# EasyEDA Pro project ProPrj_FOC_TEST_2025-02-24.epro, board PCB1_1
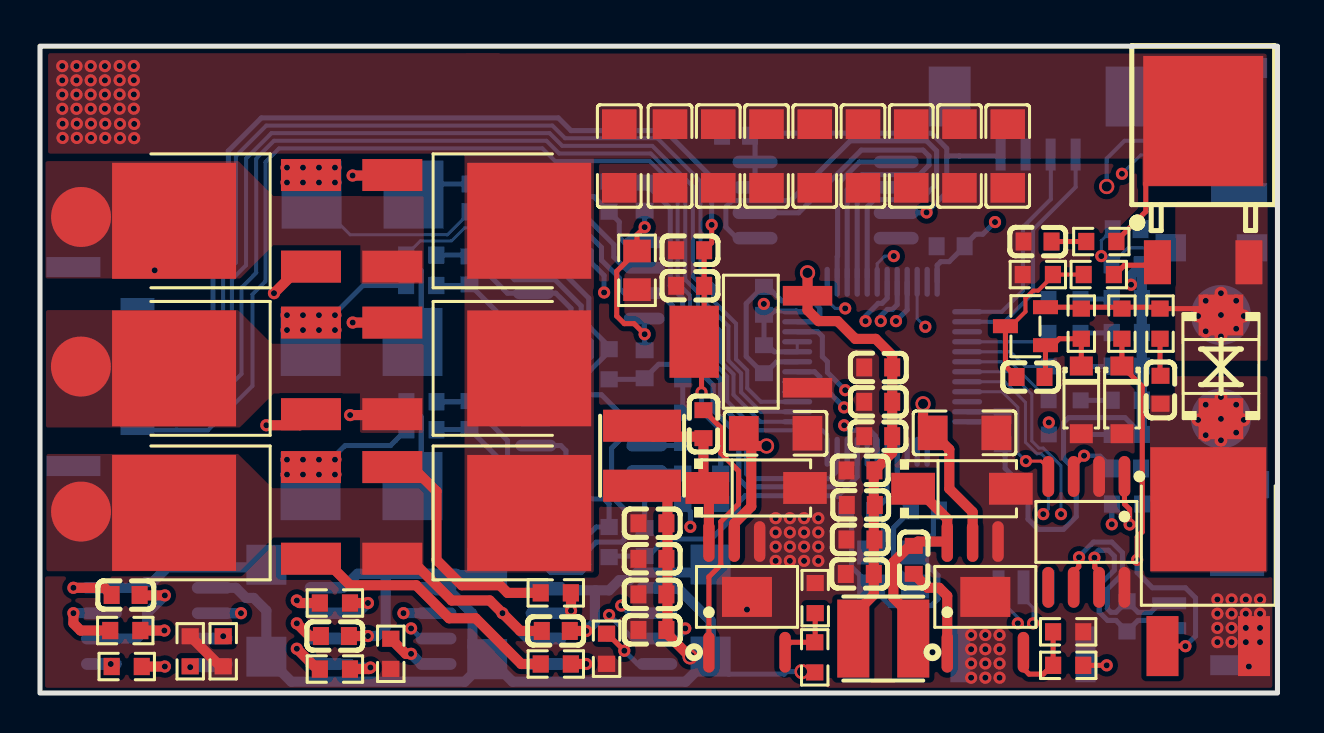
[diagram p8: board, top side]
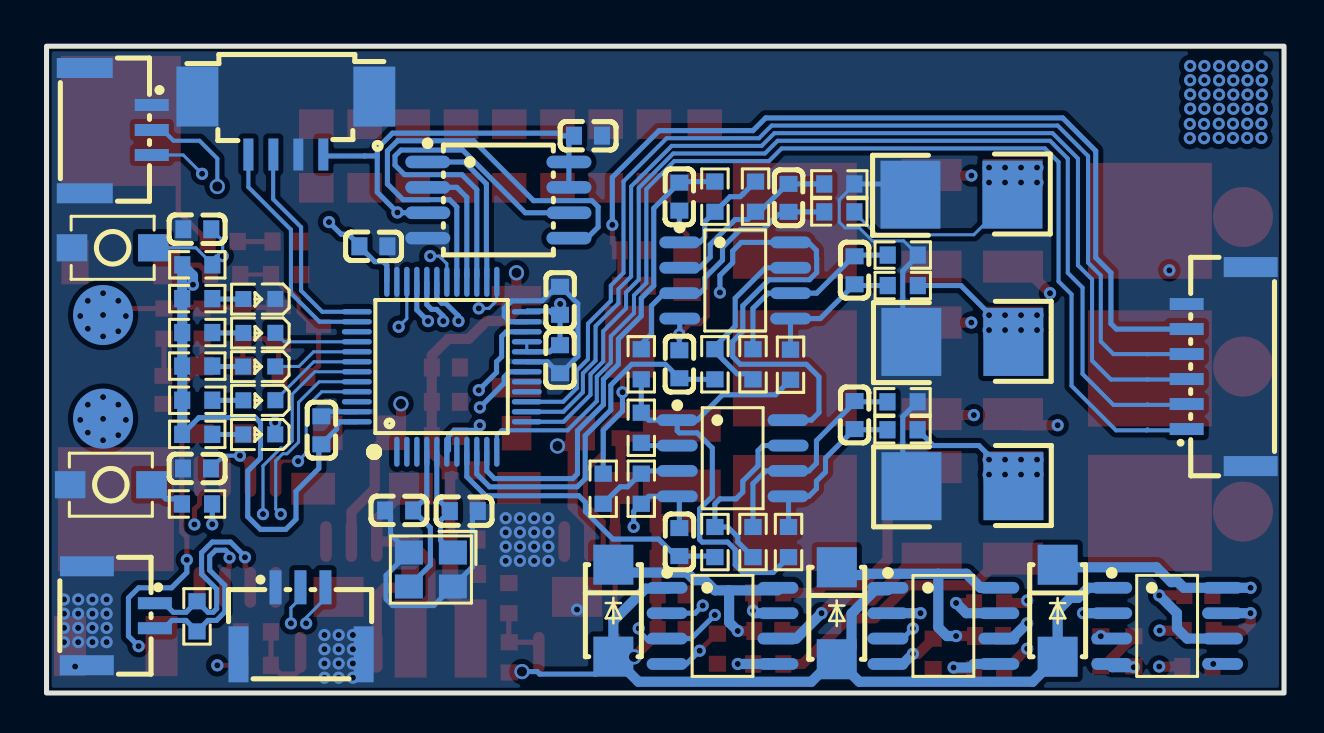
[diagram p9: board, bottom side, seen from below]

Outline 61.9 x 32.34 mm; copper layers: Top Layer, Inner1, Inner2, Bottom Layer. Coordinates in mm from the lower left corner of the outline.
Outline path: rectangle 0,32.34 61.9,0
Stack: Top Layer 0.035mm 外层铜厚1oz / Dielectric1 0.2104mm 7628 RC49% 8.6mil / Inner1 0.0152mm 内层铜厚 / Dielectric2 1.065mm 1.1mm H/HOZ 含铜 / Inner2 0.0152mm 内层铜厚 / Dielectric3 0.2104mm 7628 RC49% 8.6mil / Bottom Layer 0.035mm 外层铜厚1oz

## Design rules (mm)
net D-GND: DP1
net CAN-L: DP2
net CAN-H: DP2
net $3N2087: DP1
template: 自定义配置
spacing copperThickness1oz (default): track to track 0.102, other pairs 0.152 to 0.3
spacing copperThickness2oz: track to track 0.203, other pairs 0.152 to 0.3
track width copperThickness1oz (default): min 0.127, default 0.254, max 5.08
track width copperThickness2oz: min 0.203, default 0.254, max 2.54
differential pair differentialPair (default): width min 0.127, default 0.254, max 2.54; gap min 0.152, default 0.152
via viaSize (default): diameter min 0.5, default 0.61, max 10; hole min 0.3, default 0.305, max 6.299

## Placement (name value [footprint] x y rotation side)
C9  100nF  [C0603]  41.93 16.28 180 top
C10  100nF  [C0603]  32.52 22.14 0 top
C11  10uF  [C0603]  41.93 14.56 180 top
C12  10uF  [C0603]  32.52 20.36 0 top
C13  10uF  [C1206]  46.25 13.01 180 top
C14  10uF  [C1206]  36.8 12.99 180 top
C16  10uF  [C0603]  30.64 3.15 0 top
C17  10uF  [C0603]  30.64 4.93 0 top
C18  10uF  [C0603]  30.64 6.71 0 top
C19  22uF  [C0603]  30.64 8.49 0 top
C20  10uF  [C0603]  41.01 5.95 0 top
C21  10uF  [C0603]  41.04 7.67 0 top
C22  10uF  [C0603]  41.06 9.4 0 top
C23  10uF  [C0603]  41.04 11.13 0 top
C24  10uF  [C0603]  41.93 12.84 0 top
C28  100nF  [C0603]  54.36 23.19 180 bottom
C43  6pF  [C0603]  44.27 9.13 180 bottom
C44  100nF  [C0603]  45.55 22.34 0 bottom
C45  100nF  [C0603]  48.16 13.14 270 bottom
C48  6pF  [C0603]  41.03 9.1 0 bottom
C52  100nF  [C0603]  36.22 16.69 90 bottom
C54  100nF  [C0603]  54.38 11.23 0 bottom
C55  100nF  [C0603]  34.82 27.87 0 bottom
C56  4.7uF  [C0603]  25.8 3.1 0 top
C57  4.7uF  [C0603]  14.75 2.85 0 top
C58  4.7uF  [C0603]  4.28 4.9 180 top
C59  1uF  [C0603]  30.25 7.55 270 bottom
C60  1uF  [C0603]  30.25 16.44 270 bottom
C61  1uF  [C0603]  30.25 24.82 90 bottom
C62  47uF  [C1206]  48.41 26.85 90 top
C63  47uF  [C1206]  28.98 26.85 90 top
C64  47uF  [C1206]  31.52 26.85 90 top
C65  47uF  [C1206]  33.93 26.85 90 top
C66  47uF  [C1206]  36.34 26.85 90 top
C67  47uF  [C1206]  38.76 26.85 90 top
C68  47uF  [C1206]  41.17 26.85 90 top
C69  47uF  [C1206]  43.58 26.85 90 top
C70  47uF  [C1206]  46 26.85 90 top
C74  6pF  [C0603]  21.49 13.9 270 bottom
C75  6pF  [C0603]  21.49 21.14 270 bottom
C76  6pF  [C0603]  24.79 24.76 270 bottom
C78  1uF  [C0603]  49.9 22.58 180 top
C79  100nF  [C0603]  33.19 13.44 270 top
C80  100nF  [C0603]  43.71 6.66 90 top
C81  1uF  [C0603]  56.05 15.16 90 top
C82  100nF  [C0603]  49.55 15.8 180 top
C83  100nF  [C0603]  36.22 19.61 270 bottom
CN1  -  [CONN-SMD_1.25-4PWT]  49.93 28.38 180 bottom
D1  -  [SMB_L4.6-W3.6-LS5.3-BI]  59.08 16.31 90 top
D5  -  [SMA_L4.3-W2.5-LS5.0-FD]  46.12 10.21 180 top
D6  -  [DO-214AC_L4.3-W2.7-LS5.3-RD]  33.55 4.12 270 bottom
D7  -  [DO-214AC_L4.3-W2.7-LS5.3-RD]  22.37 3.99 270 bottom
D8  -  [DO-214AC_L4.3-W2.7-LS5.3-RD]  11.33 4.12 270 bottom
D9  -  [SMA_L4.3-W2.5-LS5.0-FD]  35.83 10.25 180 top
L4  15uH  [IND-SMD_L4.0-W4.0_FNR40XXS]  30.12 11.87 270 top
L5  15uH  [IND-SMD_L4.0-W4.0_FNR40XXS]  42.19 2.72 180 top
LED1  -  [LED_0603]  51.31 14.63 0 bottom
LED2  -  [LED_0603]  51.31 16.32 0 bottom
LED3  -  [LED_0603]  51.31 18 0 bottom
LED4  -  [LED_0603]  51.31 12.92 0 bottom
LED5  -  [LED_0603]  51.31 19.7 0 bottom
NOREF  -  [Pad_e794]  59.08 18.9 0 top
NOREF#2  -  [Pad_e793]  59.08 13.72 0 top
NOREF#3  -  [Pad_e4783]  2.05 23.8 0 top
NOREF#4  -  [Pad_e4786]  2.05 9.07 0 top
NOREF#5  -  [Pad_e4785]  2.05 16.32 0 top
Q3  -  [SOT-23-3_L2.9-W1.3-P1.90-LS2.4-BR]  49.3 18.34 0 top
Q5  -  [TO-252-2_L6.6-W6.1-P4.57-LS9.9-BR-CW]  58.44 5.77 270 top
Q6  -  [TO-252-2_L6.6-W6.1-P4.57-LS9.9-BR-CW]  21.05 9.01 180 top
Q7  -  [TO-252-2_L6.6-W6.1-P4.57-LS9.9-BR-CW]  21.05 16.23 180 top
Q8  -  [TO-252-2_L6.6-W6.1-P4.57-LS9.9-BR-CW]  21.05 23.61 180 top
Q9  -  [TO-252-2_L6.6-W6.1-P4.57-LS9.9-BR-CW]  10.13 9.01 0 top
Q10  -  [TO-252-2_L6.6-W6.1-P4.57-LS9.9-BR-CW]  10.13 16.23 0 top
Q11  -  [TO-252-2_L6.6-W6.1-P4.57-LS9.9-BR-CW]  10.13 23.61 0 top
Q13  IRFR5410TRPBF  [TO-252-2_L6.5-W6.1-P4.58-LS10.0-TR]  58.19 25.07 180 top
R1  22R  [R0603]  56.03 18.47 90 top
R4  22Ω  [R0603]  53.09 22.58 0 top
R13  10K  [R0603]  49.92 20.93 0 top
R15  0Ω  [R0805]  29.87 21.14 90 top
R19  12K  [R0603]  38.76 1.78 270 top
R20  5.1K  [R0603]  51.44 1.38 0 top
R21  1.5K  [R0603]  38.78 4.74 270 top
R22  1.5K  [R0603]  51.43 3.06 180 top
R30  120R  [R0603]  54.38 3.83 90 bottom
R31  10K  [R0603]  54.38 9.45 0 bottom
R32  10kΩ  [r0603]  54.36 21.41 0 bottom
R40  10K  [R0603]  34.06 10.21 90 bottom
R41  1K  [R0603]  19.08 14.56 180 bottom
R42  1K  [R0603]  19.08 13.16 180 bottom
R43  1K  [R0603]  19.07 21.9 180 bottom
R44  1K  [R0603]  19.07 20.37 180 bottom
R45  1K  [R0603]  22.25 25.45 180 bottom
R46  1K  [R0603]  22.25 24.06 180 bottom
R47  10R  [R0603]  14.75 4.5 180 top
R48  0R  [R0603]  17.55 1.96 90 top
R49  10R  [R0603]  14.75 1.2 180 top
R50  10K  [R0603]  32.15 10.21 90 bottom
R51  36.5K  [R0603]  26.57 7.55 90 bottom
R52  36.5K  [R0603]  24.79 7.55 90 bottom
R53  36.5K  [R0603]  26.57 16.44 90 bottom
R54  36.5K  [R0603]  24.69 16.42 90 bottom
R55  36.5K  [R0603]  26.44 24.82 270 bottom
R56  36.5K  [R0603]  32.15 16.44 90 bottom
R57  10K  [R0603]  32.15 13.26 90 bottom
R59  100R  [R0603]  28.47 7.55 90 bottom
R60  100R  [R0603]  28.47 16.44 90 bottom
R61  100R  [R0603]  28.47 24.82 270 bottom
R62  10R  [R0603]  4.27 3.12 0 top
R63  0R  [R0603]  7.52 2.09 270 top
R64  10R  [R0603]  4.34 1.32 0 top
R65  10K  [R0603]  9.17 2.09 90 top
R155  10K  [R0603]  54.37 14.64 180 bottom
R156  10K  [R0603]  54.37 16.35 180 bottom
R157  10K  [R0603]  54.37 18.02 180 bottom
R158  10K  [R0603]  54.37 12.93 180 bottom
R159  10K  [R0603]  54.37 19.72 180 bottom
R160  10R  [R0603]  25.8 5.01 180 top
R161  10R  [R0603]  25.8 1.45 180 top
R162  2mΩ  [RES-SMD_L6.4-W3.2-A]  16.09 10.34 180 bottom
R163  2mΩ  [RES-SMD_L6.4-W3.2-A]  16.09 17.55 180 bottom
R164  2mΩ  [RES-SMD_L6.4-W3.2-A]  16.14 24.92 180 bottom
R165  0R  [R0603]  28.34 2.21 90 top
R166  100K  [R0603]  54.12 18.47 90 top
R167  100K  [R0603]  52.09 18.47 90 top
R168  1K  [R0603]  52.97 20.93 0 top
SW3  轻触按键3*4*H  [SW-SMD_L4.0-W2.9-LS5.0]  58.6 22.26 0 bottom
SW4  轻触按键3*4*H  [SW-SMD_L4.0-W2.9-LS5.0]  58.69 10.42 180 bottom
U3  -  [SOIC-8_L5.0-W4.0-P1.27-LS6.0-BL-EP2.0]  35.37 4.81 0 top
U4  -  [SOIC-8_L5.0-W4.0-P1.27-LS6.0-BL-EP2.0]  47.29 4.81 0 top
U5  -  [SOT-223-4_L6.5-W3.5-P2.30-LS7.0-BR]  35.56 17.56 0 top
U12  -  [LQFP-48_L7.0-W7.0-P0.50-LS9.0-BL]  42.13 16.31 180 bottom
U13  -  [CONN-SMD_6P-P1.25_GH1.25-6PWBPZ]  3.27 16.32 90 bottom
U17  SN65HVD230DR  [SOIC-8_L4.9-W3.9-P1.27-LS6.0-BL]  52.35 8.06 180 top
U18  -  [SOIC-8_L5.2-W5.2-P1.27-LS7.9-BL]  39.3 24.65 270 bottom
U19  -  [SOIC-8_L4.9-W3.9-P1.27-LS6.0-BL]  27.45 20.63 270 bottom
U20  -  [SOIC-8_L4.9-W3.9-P1.27-LS6.0-BL]  28.09 3.36 270 bottom
U21  -  [SOIC-8_L4.9-W3.9-P1.27-LS6.0-BL]  17.04 3.36 270 bottom
U22  -  [SOIC-8_L4.9-W3.9-P1.27-LS6.0-BL]  5.85 3.36 270 bottom
U23  -  [SOIC-8_L4.9-W3.9-P1.27-LS6.0-BL]  27.58 11.74 270 bottom
U24  GH1.25-2P卧贴  [CONN-SMD_2P-P1.25_GH1.25-2PWBPZ]  58.19 3.86 270 bottom
U25  GH1.25-3P卧贴  [CONN-SMD_GH1.25-3P]  49.17 3.61 180 bottom
U26  GH1.25-3P卧贴  [CONN-SMD_GH1.25-3P]  58.32 28.12 270 bottom
X1  8MHz  [CRYSTAL-SMD_4P-L3.2-W2.5-BL]  42.68 6.17 0 bottom
ZD1  MMSZ5239B  [SOD-123_L2.8-W1.8-LS3.7-RD]  54.12 14.66 270 top
ZD2  MMSZ5239B  [SOD-123_L2.8-W1.8-LS3.7-RD]  52.09 14.66 270 top

## Footprints (pads in the part's own frame, mm; a bottom-side part is the same pattern mirrored in y, then rotated)
C0603
  rect 0.8x0.9 smd: 1(-0.7,0) 2(0.7,0)
C1206
  rect 1.485x1.728 smd: 1(-1.593,0) 2(1.593,0)
CONN-SMD_1.25-4PWT
  rect 0.5x1.6 smd: 1(1.875,-1.45) 2(0.625,-1.45) 3(-0.625,-1.45) 4(-1.875,-1.45)
  rect 2.1x2.999 smd: 5(4.425,1.45) 6(-4.425,1.45)
CONN-SMD_2P-P1.25_GH1.25-2PWBPZ
  rect 0.6x1.7 smd: 1(-0.625,1.702) 2(0.625,1.702)
  rect 1.001x2.7 smd: 3(-2.474,-1.696) 4(2.474,-1.702)
CONN-SMD_6P-P1.25_GH1.25-6PWBPZ
  rect 0.6x1.7 smd: 1(-3.125,1.6) 2(-1.875,1.6) 3(-0.625,1.6) 4(0.625,1.6) 5(1.875,1.6) 6(3.125,1.6)
  rect 1x2.7 smd: 7(-4.975,-1.6) 8(4.975,-1.6)
CONN-SMD_GH1.25-3P
  rect 0.6x1.7 smd: 1(-1.282,1.675) 2(-0.032,1.675) 3(1.218,1.675)
  rect 1x2.8 smd: 4(-3.132,-1.675) 5(3.132,-1.675)
CRYSTAL-SMD_4P-L3.2-W2.5-BL
  rect 1.4x1.2 smd: 1(-1.1,-0.85) 2(1.1,-0.85) 3(1.1,0.85) 4(-1.1,0.85)
DO-214AC_L4.3-W2.7-LS5.3-RD
  rect 1.999x1.999 smd: 1(-2.299,0) 2(2.301,0)
IND-SMD_L4.0-W4.0_FNR40XXS
  rect 1.6x3.9 smd: 1(-1.5,0) 2(1.5,0)
LED_0603
  rect 0.8x0.8 smd: 1(-0.851,-0.01) 2(0.75,-0.005)
LQFP-48_L7.0-W7.0-P0.50-LS9.0-BL
  oval 0.27x1.5 smd: 2(-2.25,-4.25) 3(-1.75,-4.25) 4(-1.25,-4.25) 5(-0.75,-4.25) 6(-0.25,-4.25) 7(0.25,-4.25) 8(0.75,-4.25) 9(1.25,-4.25) 10(1.75,-4.25) 11(2.25,-4.25) 12(2.75,-4.25) 25(2.75,4.25) 26(2.25,4.25) 27(1.75,4.25) 28(1.25,4.25) 29(0.75,4.25) 30(0.25,4.25) 31(-0.25,4.25) 32(-0.75,4.25) 33(-1.25,4.25) 34(-1.75,4.25) 35(-2.25,4.25) 36(-2.75,4.25)
  oval 1.5x0.27 smd: 13(4.25,-2.75) 14(4.25,-2.25) 15(4.25,-1.75) 16(4.25,-1.25) 17(4.25,-0.75) 18(4.25,-0.25) 19(4.25,0.25) 20(4.25,0.75) 21(4.25,1.25) 22(4.25,1.75) 23(4.25,2.25) 24(4.25,2.75) 37(-4.25,2.75) 38(-4.25,2.25) 39(-4.25,1.75) 40(-4.25,1.25) 41(-4.25,0.75) 42(-4.25,0.25) 43(-4.25,-0.25) 44(-4.25,-0.75) 45(-4.25,-1.25) 46(-4.25,-1.75) 47(-4.25,-2.25) 48(-4.25,-2.75)
Pad_e793
  round 3 smd far side: 1(0,0)
Pad_e794
  round 3 smd far side: 1(0,0)
Pad_e4783
  round 3 smd: 1(0,0)
Pad_e4785
  round 3 smd: 1(0,0)
Pad_e4786
  round 3 smd: 1(0,0)
R0603
  rect 0.806x0.864 smd: 1(-0.753,0) 2(0.753,0)
r0603
  rect 0.806x0.864 smd: 1(-0.753,0) 2(0.753,0)
R0805
  rect 1.133x1.377 smd: 1(-0.966,0) 2(0.966,0)
RES-SMD_L6.4-W3.2-A
  rect 2.999x3.401 smd: 1(-2.55,0) 2(2.55,0)
SMA_L4.3-W2.5-LS5.0-FD
  rect 2.184x1.593 smd: 1(-2.443,0) 2(2.443,0)
SMB_L4.6-W3.6-LS5.3-BI
  rect 2.047x2.24 smd: 1(-2.591,0) 2(2.591,0)
SOD-123_L2.8-W1.8-LS3.7-RD
  rect 0.95x1.15 smd: 1(-1.692,0) 2(1.692,0)
SOIC-8_L4.9-W3.9-P1.27-LS6.0-BL
  oval 0.588x2.045 smd: 1(-1.905,-2.772) 2(-0.635,-2.772) 3(0.635,-2.772) 4(1.905,-2.772) 5(1.905,2.772) 6(0.635,2.772) 7(-0.635,2.772) 8(-1.905,2.772)
SOIC-8_L5.0-W4.0-P1.27-LS6.0-BL-EP2.0
  oval 0.574x2.037 smd: 1(-1.905,-2.768) 4(1.905,-2.768) 6(0.635,2.768) 7(-0.635,2.768) 8(-1.905,2.768)
  rect 2.5x2 smd: 9(0,0)
SOIC-8_L5.2-W5.2-P1.27-LS7.9-BL
  oval 0.63x2.25 smd: 1(-1.905,-3.53) 2(-0.635,-3.53) 3(0.635,-3.53) 4(1.905,-3.53) 5(1.905,3.53) 6(0.635,3.53) 7(-0.635,3.53) 8(-1.905,3.53)
SOT-23-3_L2.9-W1.3-P1.90-LS2.4-BR
  rect 1.25x0.701 smd: 1(1.001,-0.95) 2(1.001,0.95) 3(-1.001,0)
SOT-223-4_L6.5-W3.5-P2.30-LS7.0-BR
  rect 2.47x0.98 smd: 1(2.835,-2.3) 3(2.835,2.3)
  rect 2.47x3.6 smd: 4(-2.835,0)
SW-SMD_L4.0-W2.9-LS5.0
  rect 1.53x1.36 smd: 1(-2.035,0) 2(2.035,0)
TO-252-2_L6.5-W6.1-P4.58-LS10.0-TR
  rect 1.35x2.2 smd: 1(2.29,3.533) 3(-2.29,3.533)
  rect 6x6.5 smd: 4(0,-3.533)
TO-252-2_L6.6-W6.1-P4.57-LS9.9-BR-CW
  rect 3x1.6 smd: 1(3.424,-2.29) 3(3.424,2.29)
  rect 6.2x5.8 smd: 2(-3.424,0)

## Nets
As in the schematic, except:
GROUND: C81.1 D1.1 NOREF#2.1 Q5.2
POWER: D1.2 NOREF.1 Q3.2 Q13.3 R1.2 R166.2 R167.2
U: C56.1 NOREF#4.1 Q6.3 Q9.2 U20.6
V: C57.1 NOREF#5.1 Q7.3 Q10.2 U21.6
W: C58.1 NOREF#3.1 Q8.3 Q11.2 U22.6

Pads without a net: U12 2 3 4 8 16 17 39 46; U17 5

## Via types
v1: diameter 0.61, hole 0.305, Top Layer to Bottom Layer, 149 vias
v2: diameter 0.762, hole 0.508, Top Layer to Bottom Layer, 6 vias
v3: diameter 0.65, hole 0.3, Top Layer to Bottom Layer, 42 vias

## Routing (per net, layer and track width the routed paths; a pad name or vN(x,y) marks a point on that pad's centre or on a via; arc(x,y) is an arc through that point)
3.3V: length 138.8
  Top Layer w0.254: v1(33.09,15.04) 33.09,17.2 U5.4 33.22,18.06 C12.2 C10.2 33.6,22.52 v1(33.6,23.41)
  Bottom Layer w0.152: 37.22,17.56 U12.21 U12.20
  Bottom Layer w0.254: C83.2 C52.2 36.41,17.39 36.73,17.06 U12.20 ; C83.2 36.53,18.91 36.73,19.1 37.84,19.1 U12.24 ; C83.2 36.22,19.45 v1(36.21,19.46) ; 55.12,12.94 54.28,13.77 51.46,13.77 51.2,13.52 51.2,11.74 51.84,11.1 51.84,8.82 51.2,8.18 49.93,8.18 49.43,8.69 49.43,10.09 48.28,11.23 48.28,12.31 C45.2 47.39,13.2 47.39,13.39 47.22,13.56 U12.48 ; v1(47.77,23.55) 47.17,22.94 46.81,22.94 46.25,22.39 C44.2 45.49,21.57 45.06,21.57 44.88,21.39 U12.36 ; U23.8 23.64,13.64 23.26,14.02 23.26,15.8 23.9,16.44 27.2,16.44 27.58,16.82 27.58,17.58 27.1,18.06 27.1,18.19 27.07,18.22 27.07,19.36 25.77,20.67 23.74,20.67 23.38,21.03 23.38,21.76 23.39,21.77 23.39,22.13 23.79,22.53 U19.8 27.15,22.53 27.58,22.1 27.58,21.52 28.22,20.88 v1(28.22,20.03) ; U18.7 U18.8 35.77,27.62 C55.2 36.17,27.87 36.3,27.99 44.6,27.99 45.36,27.23 45.36,26.85 ; 45.36,26.85 45.36,25.04 v1(44.35,24.03) 44.33,24.01 U18.3 ; 45.36,26.85 45.99,26.85 46,26.85 48.01,26.85 48.06,26.8 ; R40.2 34.06,13.14 33.09,14.1 v1(33.09,15.04) ; v1(33.6,23.41) 33.6,25.78 31.26,28.12 26.57,28.12 25.93,28.76 11.07,28.76 9.42,27.11 9.42,21.77 8.66,21.01 8.66,18.47 8.39,18.2 U13.5
  Bottom Layer w0.508: v1(54.58,20.42) 54.58,20.88 R32.2 55.12,19.72 R159.1 55.12,19.72 55.12,12.94 R158.1
5V: length 79.7
  Top Layer w0.254: U17.3 51.71,11.36 52.22,11.87 v1(52.23,11.87) ; 52.19,1.38 v1(53.36,1.38)
  Top Layer w0.508: v2(38.4,21.01) U5.3 38.4,19.15 38.95,18.6 39.9,18.6 40.79,17.71 41.81,17.71 42.63,16.88 C9.1 C11.1 C24.2 42.63,12.02 41.71,11.1 C20.2 41.71,4.91 40.58,3.79 40.58,2.84
  Inner1 w0.508: v2(38.4,21.01) 43.33,21.01 47.65,25.33 v2(53.36,25.33) 55.52,23.17 55.52,8.31 54.63,7.42 53.99,7.42 ; 53.99,7.42 53.99,2.01 v1(53.36,1.38) ; 53.99,7.42 53.36,7.42 52.74,8.04 52.74,11.36 v1(52.23,11.87)
  Bottom Layer w0.203: v2(53.36,25.33) 53.36,26.72 54.25,27.61 55.55,27.61 56.06,28.12 56.61,28.12 ; v1(52.23,11.87) 53.04,11.87 C54.1
5V-FD: length 4.3
  Top Layer w0.254: U4.4 49.3,1.93 49.3,1.12 49.48,0.94 50.19,0.94 50.63,1.38 R20.1 50.68,1.39 50.68,3.06
11V: length 56.7
  Top Layer w0.254: R19.2 38.72,1.07 v2(38.12,1.07)
  Top Layer w0.508: v2(32.52,1.81) 31.39,2.94 31.39,10.25 30.06,10.25
  Bottom Layer w0.254: v2(38.12,1.07) 37.36,1.07 37.23,0.94 34.44,0.94 33.57,1.82 D6.2
  Bottom Layer w0.508: D6.2 33.55,3.61 31.94,5.22 30.84,5.22 ; D6.2 32.3,0.56 23.64,0.56 22.52,1.69 22.37,1.69 22.31,1.62 ; D6.2 32.53,1.82 v2(32.52,1.81) ; 22.31,1.62 21.63,2.3 21.63,3.97 20.47,5.13 19.81,5.13 ; 22.31,1.62 21.25,0.56 12.58,0.56 D8.2 11.33,4.12 10.69,4.75 10.31,4.75 9.8,5.26 U22.1
12V-FD: length 3.9
  Top Layer w0.254: R21.2 38.78,2.56 R19.1 37.56,2.54 37.27,2.25 37.27,1.4
24V-CALC-OUT: length 22.5
  Top Layer w0.254: Q13.4 58.19,28.36 55.32,25.48 55.32,24.08 53.85,22.6 R4.2
  Top Layer w0.508: U3.7 34.73,8.48 35.58,9.33 35.58,12.61 ; v2(36.34,12.35) 35.84,12.35 35.58,12.61 ; v2(44.18,14.46) 44.18,13.49 C13.2 45.49,12.18 45.49,10.21 46.66,9.05 U4.7 ; 35.58,12.61 C14.2
  vias: v1(1.11,31.35) v1(1.11,30.64) v1(1.11,29.93) v1(1.11,29.21) v1(1.13,28.47) v1(1.13,27.76) v1(1.83,31.35) v1(1.83,30.64) v1(1.83,29.93) v1(1.83,29.21) v1(1.84,28.47) v1(1.84,27.76) v1(2.54,31.35) v1(2.54,30.64) v1(2.54,29.93) v1(2.54,29.21) v1(2.55,28.47) v1(2.55,27.76) v1(3.25,31.35) v1(3.25,30.64) v1(3.25,29.93) v1(3.25,29.21) v1(3.27,28.47) v1(3.27,27.76) v1(3.98,31.35) v1(3.98,30.64) v1(3.98,29.93) v1(3.98,29.22) v1(4,28.46) v1(4,27.75) v1(4.7,31.35) v1(4.7,30.64) v1(4.7,29.93) v1(4.7,29.22) v1(4.71,28.46) v1(4.71,27.75)
AGND: length 14.3
  Top Layer w0.254: v1(30.25,23.3) 29.87,22.91 R15.2 28.85,21.09 28.85,18.85 29.23,18.47 29.72,18.47 v1(30.25,17.94) ; 29.82,21.72 29.99,21.72
  Bottom Layer w0.254: C59.1 30.25,9.73 U23.4 31.78,9.83 R50.1 32.53,9.08 v1(32.53,8.31) ; C60.1 v1(30.25,17.94) 30.23,17.96 U19.4 ; v1(30.25,23.3) C61.1
V1: length 19.7
  Top Layer w0.508: v1(15.64,18.52) 17.62,18.52 ; R47.2 12.98,4.5 v1(12.85,4.63)
  Inner1 w0.508: v1(15.64,18.52) 15.64,17.51 14.37,16.24 14.37,13.16 15.64,11.89 15.64,6.66 13.61,4.63 v1(12.85,4.63)
V2: length 15.8
  Top Layer w0.508: R49.2 13.87,1.2 v1(12.85,2.21) ; v1(11.33,13.39) 13,13.39 Q10.1
  Inner1 w0.508: v1(12.85,2.21) 11.33,3.74 v1(11.33,13.39)
ADC-U: length 15.6
  Bottom Layer w0.254: R59.1 28.52,6.85 C59.2 30.44,6.85 31.29,7.7 33.57,7.7 34.95,9.07 34.95,9.53 35.28,9.87 39.85,9.87 39.89,9.82 40.88,10.81 U12.9
ADC-V: length 18.1
  Bottom Layer w0.254: U12.10 40.38,10.95 39.74,10.31 35.36,10.31 34.96,10.71 34.96,12.87 33.68,14.15 33.68,15.39 32.63,16.44 30.95,16.44 30.2,15.68 R60.1
ADC-W: length 24.2
  Bottom Layer w0.254: R61.1 30.2,25.57 C61.2 31.53,24.24 31.53,20.36 32.15,19.74 32.15,18.85 33.3,17.71 33.3,16.44 34.05,15.69 34.05,14.42 35.35,13.12 35.35,10.96 35.58,10.72 39.5,10.72 39.88,11.1 U12.11
CAN-H: length 10.3
  Top Layer w0.254: U17.7 52.98,6.06 52.77,6.28 52.77,6.75 v1(52.75,6.77)
  Bottom Layer w0.254: v1(52.75,6.77) 52.75,6.94 52.96,7.14 53.45,7.14 53.74,6.85 53.74,6.14 52.99,5.39 52.99,4.05 53.41,3.63 53.83,3.63 R30.1 54.93,3.63 55.63,3.63 56.02,3.24 U24.2
CAN-L: length 11.3
  Top Layer w0.254: U17.6 51.71,6.06 51.97,6.31 51.97,6.77 v1(51.98,6.79)
  Bottom Layer w0.254: v1(51.98,6.79) 51.98,6.83 52.7,7.55 53.62,7.55 54.15,7.01 54.15,5.95 53.39,5.19 53.39,4.22 53.57,4.04 53.83,4.04 R30.2 54.93,4.04 55.56,4.04 56.02,4.49 U24.1
D-GND: length 49.1
  Top Layer w0.508: R63.1 9.02,1.33 R65.1
  Bottom Layer w0.152: R43.2 19.03,22.61 20.59,22.61 21.24,23.26 21.96,23.26 22.25,23.55 22.25,24.67 21.49,25.43 R45.2
  Bottom Layer w0.254: 36.22,20.29 36.43,20.29 37.11,19.61 38.63,19.61 39.01,19.23 39.01,18.85 38.72,18.56 U12.23 ; 36.28,15.99 36.85,16.56 U12.19 ; R41.2 19.07,13.82 19.07,10.84 18.57,10.34 ; C48.1 40.6,8.82 40.6,6.3 X1.4 42.53,4.37 44.6,4.37 44.92,4.7 44.92,5.88 X1.2 44.7,7.94 44.7,8.86 C43.1 ; R164.1 19.55,24.92 20.09,25.45 R45.2 ; R163.1 18.64,17.76 19.07,18.19 19.07,21.12 18.32,21.87 R43.2 ; U12.47 47.93,14.06 C45.1 ; C83.1 36.17,20.31 35.33,19.47 35.33,16.83 36.17,15.99 C52.1 ; 18.5,17.46 18.62,17.58
  vias: v1(35.37,4.17) v1(36.8,8.74) v1(36.8,8.03) v1(36.8,7.32) v1(36.8,6.61) v1(37.51,8.74) v1(37.51,8.03) v1(37.51,7.32) v1(37.51,6.61) v1(38.22,8.74) v1(38.22,8.03) v1(38.22,7.32) v1(38.22,6.61) v1(38.94,8.74) v1(38.94,8.03) v1(38.94,7.32) v1(38.94,6.61) v1(46.58,2.9) v1(46.58,2.19) v1(46.58,1.48) v1(46.58,0.77) v1(47.29,2.9) v1(47.29,2.19) v1(47.29,1.48) v1(47.29,0.77) v1(48,2.9) v1(48,2.19) v1(48,1.48) v1(48,0.77) v1(58.9,4.68) v1(58.9,3.97) v1(58.9,3.26) v1(58.9,2.54) v1(59.61,4.68) v1(59.61,3.97) v1(59.61,3.26) v1(59.61,2.54) v1(60.32,4.68) v1(60.32,3.97) v1(60.32,3.26) v1(60.32,2.54) v1(60.47,1.32) v1(61.03,4.68) v1(61.03,3.97) v1(61.03,3.26) v1(61.03,2.54)
FDCAN-RX: length 7.4
  Top Layer w0.152: U17.4 50.44,11.23 50.08,11.59 v1(49.32,11.59)
  Bottom Layer w0.152: v1(49.32,11.59) 48.92,12 48.92,14.28 48.14,15.06 U12.45
FDCAN-TX: length 21.9
  Top Layer w0.254: U17.1 54.25,9.45 54.51,9.2 v1(54.51,8.43)
  Inner1 w0.254: v1(44.29,18.31) 44.29,16.49 44.85,15.93 49.68,15.93 54.25,11.36 54.25,9.45 54.51,9.2 v1(54.51,8.43)
  Bottom Layer w0.152: v1(44.29,18.31) 43.88,18.72 U12.34
GROUND:
  vias: v3(57.93,13.66) v3(58.32,14.42) v3(58.32,12.89) v3(59.08,14.8) v3(59.08,13.71) v3(59.08,12.64) v3(59.84,14.42) v3(59.84,13.02) v3(60.22,13.66)
I-VREF: length 23.5
  Bottom Layer w0.254: U23.1 31.78,13.64 R57.2 R56.1 ; U23.1 30.35,13.11 30.25,13.01 29.36,13.01 28.6,12.25 28.6,9.83 29.23,9.2 29.23,7.67 29.11,7.55 27.84,7.55 27.45,7.17 27.45,6.4 27.07,6.02 25.56,6.02 R52.1 ; U23.1 29.36,13.64 28.09,14.91 25.44,14.91 R54.1
ID_BUTTON: length 23.5
  Inner1 w0.254: v1(40.28,15.14) 40.89,15.14 41.25,15.5 49.48,15.5 53.62,11.36 53.62,8.56
  Bottom Layer w0.254: R31.1 53.62,9.44 v1(53.62,8.44) ; U12.22 38.91,18.06 39.14,17.83 39.14,16.82 39.39,16.56 39.39,16.03 v1(40.28,15.14)
LED0: length 4.9
  Bottom Layer w0.152: LED1.1 48.54,16.56 U12.42
LED1: length 4.4
  Bottom Layer w0.152: U12.41 48.55,17.06 49.28,16.33 50.46,16.33
LED2: length 4.3
  Bottom Layer w0.152: LED3.1 50.01,17.56 U12.40
LED-WARNING: length 15.3
  Inner1 w0.254: v1(50.47,13.53) 50.47,13.87 49.2,15.14 41.53,15.14 40.66,14.28 v1(40.23,14.28)
  Bottom Layer w0.254: v1(40.23,14.28) 39.01,15.49 39.01,15.8 38.75,16.06 U12.18 ; LED4.1 50.47,12.94 v1(50.47,13.53)
MOTOR_CSN: length 66.6
  Inner1 w0.254: v1(9.17,2.84) 11.32,0.69 13.61,0.69 15.01,2.09 17.42,2.09 v1(18.56,3.23) 18.95,3.61 18.95,4.25 22.25,7.55 27.84,7.55 28.34,7.04 28.34,4.03 v1(28.47,3.9) ; v1(40.28,19.23) 43.15,19.23 43.41,18.98 43.41,17.53 42.06,16.18 33.3,16.18 29.74,12.63 29.74,3.99 30.5,3.23 v1(32.28,3.23)
  Bottom Layer w0.152: U12.25 39.39,20.55 39.39,19.61 39.77,19.23 v1(40.28,19.23)
  Bottom Layer w0.254: v1(28.47,3.9) 29.65,2.72 U20.3 ; v1(18.56,3.23) 19.07,2.72 U21.3 ; 30.86,2.59 31.77,2.59 32.28,3.1 v1(32.28,3.23)
NRST: length 32.3
  Inner1 w0.152: v1(53.09,21.85) 53.09,24.45 52.98,24.57 47.77,24.57 43.71,20.5 43.71,17.2 42.31,15.8 40.15,15.8 39.65,15.29 39.65,13.97 v1(40.23,13.39)
  Bottom Layer w0.152: 53.72,21.55 53.61,21.44 R32.1 ; 53.72,21.55 53.42,21.85 v1(53.09,21.85) 53.09,22.62 C28.2 ; 53.72,21.55 54.43,22.26 SW3.1
  Bottom Layer w0.254: v1(40.23,13.39) 40.48,13.14 41.51,13.14 41.8,12.85 41.8,12.15 U12.7
OSC+: length 7.8
  Bottom Layer w0.254: X1.3 42.7,6.4 42.7,8.27 C43.2 42.88,9.82 U12.5
OSC-: length 5.8
  Bottom Layer w0.254: X1.1 42.2,7.64 42.2,8.63 41.73,9.1 42.38,9.75 U12.6
POWER: length 8.8
  Top Layer w0.254: v3(59.08,18.9) 58.76,19.22 R1.2 55.96,19.29 50.43,19.29
  vias: v3(57.93,18.85) v3(58.32,19.61) v3(58.32,18.09) v3(59.08,19.99) v3(59.08,17.83) v3(59.84,19.61) v3(59.84,18.22) v3(60.22,18.85)
PWM-U: length 29.3
  Inner1 w0.508: v1(42.82,18.6) 42.82,17.71 41.81,16.69 32.92,16.69 29.08,12.86 v1(29.08,4.37)
  Bottom Layer w0.254: U12.33 43.38,19.16 v1(42.82,18.6) ; 30.86,3.99 29.46,3.99 v1(29.08,4.37)
PWM-V: length 36.7
  Inner1 w0.508: v1(42.06,18.6) 42.06,18.04 41.35,17.33 32.28,17.33 28.25,13.29 28.25,10.12 26.44,8.31 21.61,8.31 18.18,4.88 v1(18.18,3.99)
  Bottom Layer w0.254: v1(42.06,18.6) 42.06,18.85 42.39,19.18 42.64,19.18 42.88,19.42 U12.32
  Bottom Layer w0.508: v1(18.18,3.99) 19.81,3.99
PWM-W: length 46.5
  Inner1 w0.508: v1(41.3,18.6) 40.79,18.09 31.52,18.09 27.2,13.77 27.2,10.6 25.84,9.23 21.01,9.23 17.39,5.61 17.39,4.21 16.79,3.61 15.39,3.61 13.1,1.32 12.09,1.32 10.06,3.36 v1(10.06,3.99)
  Bottom Layer w0.254: U12.31 42.38,19.74 42.13,19.49 41.93,19.49 41.3,18.85 v1(41.3,18.6)
  Bottom Layer w0.508: 8.62,3.99 10.06,3.99
SPI1-CLK: length 54.9
  Bottom Layer w0.203: 6.86,14.41 8.53,14.41 10.08,15.95 10.08,20.27 10.82,21.01 10.82,26.72 11.71,27.61 25.33,27.61 25.97,26.98 30.55,26.98 32.28,25.25 32.28,20.67 32.92,20.03 32.92,19.23 34.06,18.09 34.06,16.57 34.69,15.94 34.69,14.91 36.04,13.56 U12.13 ; 6.86,14.41 4.91,14.41 U13.2 ; 6.86,14.41 6.83,14.44
SPI1-CSN: length 58.2
  Bottom Layer w0.203: 6.88,13.14 4.93,13.14 U13.1 ; 6.88,13.14 6.83,13.19 ; 6.88,13.14 8.4,13.14 10.63,15.36 10.63,19.93 11.28,20.58 11.28,26.55 11.96,27.23 25.13,27.23 25.77,26.6 30.5,26.6 31.9,25.2 31.9,20.5 32.52,19.88 32.52,18.99 33.68,17.83 33.68,16.52 34.38,15.82 34.38,14.59 35.84,13.14 39.14,13.14 39.38,12.89 U12.12
SPI1-MISO: length 54
  Bottom Layer w0.203: U13.3 4.89,15.68 6.84,15.68 ; 6.84,15.68 8.66,15.68 9.6,16.62 9.6,20.69 10.31,21.39 10.31,26.72 11.58,27.99 25.49,27.99 26.13,27.36 30.63,27.36 32.66,25.33 32.66,20.83 33.3,20.19 33.3,19.49 34.44,18.34 34.44,16.62 35.07,15.99 35.07,15.04 36.05,14.06 U12.14 ; 6.84,15.68 6.83,15.69
SPI1-MOSI: length 53.2
  Bottom Layer w0.203: 6.84,16.95 8.53,16.95 9.17,17.58 9.17,20.88 9.8,21.52 9.8,26.85 11.33,28.38 25.63,28.38 26.27,27.74 30.88,27.74 33.04,25.58 33.04,21.01 33.68,20.37 33.68,19.61 34.82,18.47 34.82,16.69 35.38,16.13 35.38,15.24 36.06,14.56 U12.15 ; 6.84,16.95 4.87,16.95 U13.4 ; 6.84,16.95 6.83,16.94
SPI2-CLK: length 19.5
  Bottom Layer w0.254: 40.38,20.82 40.38,25.17 41.13,25.92 44,25.92 44.47,26.39 44.47,26.85 44.18,27.15 41.09,27.15 37.95,24.01 U18.6
SPI2-CSN: length 8
  Bottom Layer w0.254: 39.88,20.82 39.88,21.82 39.9,21.84 39.9,25.45 41,26.55 U18.1
SPI2-MISO: length 6.1
  Bottom Layer w0.254: 40.88,20.82 40.88,24.78 41.38,25.28 U18.2
SPI2-MOSI: length 23.9
  Bottom Layer w0.254: U18.5 34.86,22.74 34.31,23.3 34.31,24.31 34.62,24.62 37.54,24.62 40.54,27.61 44.35,27.61 44.85,27.11 44.85,25.45 44.07,24.67 41.74,24.67 41.38,24.31 41.38,20.82
SWCLK: length 11.7
  Bottom Layer w0.203: U12.38 48.25,18.56 49.68,19.99 49.68,23.17 51.81,25.3 CN1.4
SWDIO: length 10.6
  Bottom Layer w0.203: CN1.3 50.57,26.92 50.57,24.69 49.17,23.3 49.17,20.12 48.11,19.06 U12.37
TIM1-CH1: length 17.9
  Inner1 w0.152: v1(54.12,25.96) 47.39,25.96 43.28,21.85 v1(42.71,21.85)
  Bottom Layer w0.152: 56.59,26.85 56.59,26.9 55.06,26.9 v1(54.12,25.96) ; v1(42.71,21.85) 42.26,21.85 41.88,21.47 U12.30
U: length 11.7
  Top Layer w0.508: C56.1 24.03,3.1 v1(23.14,3.99) 22.5,4.63 20.6,4.63 18.25,6.97 17.63,6.97
  Bottom Layer w0.508: 25.19,2.72 24.41,2.72 v1(23.14,3.99)
U1: length 12.1
  Top Layer w0.508: R160.2 23.39,5.01 23.01,5.39 21.1,5.39 19.83,6.66 19.83,10.09 18.37,11.55 17.63,11.55
U2: length 13.7
  Top Layer w0.508: R161.2 24.08,1.45 21.79,3.74 20.47,3.74 18.82,5.39 15.52,5.39 14.19,6.72 Q9.1
USART1-RX: length 17.8
  Inner1 w0.152: v1(50.19,8.94) 48.92,7.67 v1(48.92,3.48)
  Bottom Layer w0.152: v1(48.92,3.48) 48.92,3.77 47.95,4.74 U25.3 ; U12.44 48.27,15.56 49.3,14.53 49.3,12.54 49.87,11.96 50.09,11.96 50.44,11.61 50.44,9.2 v1(50.19,8.94)
USART1-TX: length 18.5
  Inner1 w0.152: v1(49.68,3.48) 49.68,7.55 v1(51.08,8.94)
  Bottom Layer w0.152: v1(51.08,8.94) 51.08,11.36 50.19,12.25 49.97,12.25 49.62,12.6 49.62,14.94 48.49,16.06 U12.43 ; U25.2 49.2,4.74 49.68,4.26 v1(49.68,3.48)
V: length 18.4
  Top Layer w0.508: Q7.3 17.58,13.9 v1(15.52,13.9) ; v1(12.85,3.48) 13.48,2.85 C57.1
  Inner1 w0.508: v1(15.52,13.9) 15.52,13.15 16.66,12.01 16.66,6 14.15,3.48 v1(12.85,3.48)
  Bottom Layer w0.508: 14.14,2.72 13.61,2.72 v1(12.85,3.48)
W: length 24.2
  Top Layer w0.508: C58.1 5.01,4.88 v1(6.25,4.88)
  Inner1 w0.508: v1(6.25,4.88) 8.28,6.91 8.28,19.1 6.25,21.14 v1(5.74,21.14)
  Bottom Layer w0.508: v1(6.25,4.88) 5.36,3.99 5.36,3.23 4.85,2.72 U22.6
W1: length 31.7
  Top Layer w0.508: Q8.1 17.6,25.88 v1(15.64,25.88) ; R62.2 v1(6.22,3.12)
  Inner1 w0.508: v1(6.22,3.12) 9.17,6.07 9.17,19.36 11.58,21.77 14.75,21.77 15.64,22.66 v1(15.64,25.88)
W2: length 24.5
  Top Layer w0.508: v1(11.71,19.99) 13.03,21.32 Q11.1 ; R64.2 v1(6.25,1.32)
  Inner1 w0.508: v1(6.25,1.32) 10.06,5.13 10.06,18.34 v1(11.71,19.99)
$1N6953: length 1.6
  Bottom Layer w0.254: LED1.2 53.61,14.64 R155.2
$1N6979: length 1.6
  Bottom Layer w0.254: R156.2 53.59,16.32 LED2.2
$1N7005: length 1.6
  Bottom Layer w0.254: LED3.2 53.59,18.01 R157.2
$1N7093: length 1.6
  Bottom Layer w0.254: LED4.2 53.61,12.93 R158.2
$1N7148: length 1.6
  Bottom Layer w0.254: LED5.2 53.59,19.7 R159.2
$1N7337: length 1.9
  Bottom Layer w0.254: SW4.2 55.94,9.71 55.39,9.71 R31.2
$2N12458: length 1.7
  Top Layer w0.254: C78.1 R4.1
$2N13942: length 4.9
  Top Layer w0.508: U4.1 45.39,4.86 44.98,5.26 44.41,5.26 C80.1
$2N13950: length 10.7
  Top Layer w0.508: L5.1 43.69,3.76 42.69,4.75 42.69,6.54 43.51,7.36 C80.2 43.93,7.58 U4.8 45.39,8.71 43.84,10.25
$2N13955: length 13.4
  Top Layer w0.254: C79.1 34.06,13.28 34.06,11.99 34.95,11.1 34.95,9.45 34.06,8.56 34.06,6.4 33.46,5.81 U3.1
$2N13958: length 8.6
  Top Layer w0.508: U3.8 33.46,10.17 D9.2 33.19,10.44 C79.2 33.11,12.82 30.67,12.82 L4.1
$2N15647: length 1.9
  Top Layer w0.254: R1.1 56.03,15.89 C81.2
$2N15648: length 19.4
  Top Layer w0.254: R166.1 ZD1.1 55.14,15.34 55.14,8.06 54.89,7.8 v1(54.89,6.66) ; Q5.1 57.29,2.35 v1(57.3,2.34)
  Bottom Layer w0.254: v1(54.89,6.66) 54.89,6.02 55.65,5.26 57.3,5.26 57.81,4.75 57.81,2.85 v1(57.3,2.34)
$2N15651: length 8.2
  Top Layer w0.203: R168.1 R13.2 50.67,20.86 49.93,20.12 49.68,20.12 49.3,19.74 49.3,19.07 48.57,18.34 Q3.3
  Top Layer w0.254: Q3.3 48.3,16.36 C82.2
$2N15656: length 2.4
  Top Layer w0.254: R168.2 53.79,20.93 54.25,21.39 55.27,21.39 55.42,21.54 Q13.1
$2N15879: length 4.9
  Top Layer w0.254: ZD2.1 R167.1 50.99,17.72 50.84,17.56 50.47,17.56 Q3.1 50.3,15.85 C82.1
$3N2085: length 6.2
  Bottom Layer w0.254: 13.47,10.34 13.47,10.59 15.26,12.37 17.54,12.37 R42.2
  vias: v3(12.36,11.67) v3(12.36,10.92) v3(13.16,11.67) v3(13.16,10.92) v3(13.96,11.67) v3(13.96,10.92) v3(14.76,11.67) v3(14.76,10.92)
$3N2087: length 9.8
  Bottom Layer w0.152: R46.2 21.49,24.03 20.38,22.91 15.52,22.91 13.59,24.84 R164.2
  Bottom Layer w0.254: 13.4,24.94 13.4,24.44
  vias: v3(12.36,26.27) v3(12.36,25.53) v3(13.16,26.27) v3(13.16,25.53) v3(13.96,26.27) v3(13.96,25.53) v3(14.76,26.27) v3(14.76,25.53)
$3N2102: length 1.9
  Top Layer w0.508: v1(26.57,4.12) 26.57,4.75 26.56,4.75
  Bottom Layer w0.508: 25.32,3.99 26.44,3.99 v1(26.57,4.12)
$3N2107: length 2.8
  Top Layer w0.508: v1(27.33,1.45) 26.68,1.45 26.56,1.32
  Bottom Layer w0.508: U20.5 v1(27.33,1.45)
$3N2110: length 3.3
  Top Layer w0.508: R47.1 15.51,4.51 15.52,4.5 v1(16.41,4.5)
  Bottom Layer w0.508: 14.27,3.99 15.9,3.99 v1(16.41,4.5)
$3N2115: length 3.4
  Top Layer w0.508: v1(16.53,1.27) 16.46,1.2 R49.1
  Bottom Layer w0.508: U21.5 15.52,1.45 15.69,1.27 v1(16.53,1.27)
$3N2118: length 3.9
  Top Layer w0.508: R62.1 2.03,3.12 1.67,3.48 v1(1.67,3.99)
  Bottom Layer w0.508: v1(1.67,3.99) 3.07,3.99 3.07,3.99
$3N2123:
  vias: v1(3.54,1.45)
$3N2134: length 12.4
  Top Layer w0.508: C58.2 3.22,5.26 v1(1.67,5.26)
  Bottom Layer w0.508: U22.8 3.3,5.26 ; U22.8 v1(1.67,5.26) ; U22.8 3.09,5.28 3.31,5.28 3.3,5.26 ; 3.3,5.26 5.01,5.26 5.29,5.54 5.64,5.54 6.38,6.29 11.33,6.29
$3N2135: length 13.4
  Top Layer w0.508: v1(16.41,2.85) C57.2
  Bottom Layer w0.508: 17.29,5.96 17.29,3.28 16.86,2.85 v1(16.41,2.85) ; 17.29,5.96 15.88,5.96 15.19,5.26 14.45,5.26 ; 17.29,5.96 20.83,5.96 20.89,5.9 22.3,5.9 22.68,6.28
$3N2136: length 11.8
  Top Layer w0.508: v1(27.33,3.1) C56.2
  Bottom Layer w0.508: 27.79,5.13 28.47,5.13 28.98,5.64 29.49,5.64 29.87,6.02 33.16,6.02 D6.1 ; 27.79,5.13 25.32,5.13 ; 27.79,5.13 27.76,5.1 27.76,3.54 v1(27.33,3.1)
$3N2146: length 6.1
  Bottom Layer w0.254: R44.2 16.16,20.37 13.54,17.76 R163.2
  vias: v3(12.36,18.9) v3(12.36,18.15) v3(13.16,18.9) v3(13.16,18.15) v3(13.96,18.9) v3(13.96,18.15) v3(14.76,18.9) v3(14.76,18.15)
$3N2147: length 7.1
  Bottom Layer w0.254: R54.2 24.69,18.72 U19.5 23.2,18.72 C75.2 21.42,20.37 R44.1
$3N2148: length 13.2
  Bottom Layer w0.254: 25.3,23.93 26.06,23.17 27.2,23.17 28.09,22.28 28.09,21.64 28.98,20.76 28.98,20.25 29.23,19.99 U19.3 31.01,19.99 31.65,19.36 31.65,17.96 32.41,17.2 32.41,17.19 ; R46.1 24.79,24.06
$3N2149: length 8.6
  Bottom Layer w0.254: R52.2 24.79,9.81 U23.5 23.77,9.83 23.39,10.21 23.39,10.6 22.94,11.05 22.94,11.75 C74.2 21.45,13.16 R42.1
$3N2152: length 11.3
  Bottom Layer w0.254: R51.2 26.57,10.47 25.93,11.1 U23.6 23.77,11.1 23.39,11.48 23.39,12.62 21.45,14.56 R41.1
$3N2153: length 9.9
  Bottom Layer w0.254: R43.1 21.42,21.9 C75.1 21.54,21.84 23.38,19.99 U19.6 25.8,19.99 26.57,19.23 R53.2
$3N2154: length 9.3
  Bottom Layer w0.254: U19.2 29.24,21.26 28.71,21.8 28.71,22.43 27.45,23.68 26.83,23.68 R55.2 26.23,24.07 24.84,25.46 C76.1 24.78,25.45 R45.1
$3N2156: length 3
  Top Layer w0.254: v1(29.23,2.11) 28.63,2.71 28.34,2.71
  Bottom Layer w0.254: U20.4 29.9,1.45 v1(29.23,2.11)
$3N2159: length 2.8
  Top Layer w0.508: R48.2 18.3,1.96 v1(18.56,1.96)
  Bottom Layer w0.508: v1(18.56,1.96) 19.07,1.46 19.81,1.46 U21.4
$3N2161: length 1.1
  Bottom Layer w0.508: v1(7.52,1.29) 8.59,1.29 8.62,1.32
$3N2163: length 1.9
  Bottom Layer w0.254: U23.2 32.02,12.37 R57.1
$3N2166: length 4.4
  Bottom Layer w0.254: U23.3 32.02,11.1 R50.2 32.18,10.97 32.84,10.31 33.21,10.31 R40.1
$3N2167: length 9.5
  Bottom Layer w0.254: R51.1 27.33,7.56 27.33,7.8 27.83,8.3 R59.2 28.47,9.45 28.22,9.71 27.41,9.71 27.07,10.05 27.07,10.6 26.31,11.36 26.31,12.12 26.06,12.37 U23.7
$3N2168: length 9
  Bottom Layer w0.254: U19.7 25.93,21.26 27.45,19.74 27.45,18.34 28.47,17.33 R60.2 28.47,17.08 27.36,15.97 26.85,15.97 R53.1
$3N2169: length 5.5
  Bottom Layer w0.254: U19.1 29.23,22.53 28.98,22.79 28.98,23.56 R61.2 28.46,24.07 27.71,24.82 27.2,24.82 27.07,24.95 27.06,24.95 R55.1

## Copper pours and planes (outline as drawn; the poured copper is in the pictures)
3.3V on Inner2: 27.76,24.44 56.15,24.44 56.15,18.22 27.76,18.22
24V-CALC-OUT on Top Layer: 61.36,25.33 61.36,31.97 21.24,31.97 21.24,6.02 27.71,6.02 27.71,26.72 55.14,26.72 55.14,25.33
24V-CALC-OUT on Top Layer: 22.99,31.99 0.4,31.99 0.4,26.97 23.02,26.97 24.66,25.33 24.66,30.33
24V-CALC-OUT on Inner2: 0.26,32.09 61.65,32.09 61.65,5.81 0.26,5.81
AGND on Inner2: 29.36,19.09 33.09,19.09 33.09,7.68 29.36,7.68
DGND on Inner1: -51.67,-10.99 22.37,-10.99 22.76,-11.38 22.76,-45.16 18.82,-49.09 -48.62,-49.09 -52.05,-45.67 -52.05,-11.38
D-GND on Top Layer: -7.22,40.44 79.4,40.44 80.41,39.42 80.41,-5.41 75.21,-10.61 -5.31,-10.61 -7.09,-8.84 -7.09,40.31
D-GND on Bottom Layer: -4.67,36.21 72.42,36.21 72.42,-3.42 71.03,-4.81 -4.03,-4.81 -5.43,-3.42 -5.43,35.45
D-GND on Inner2: 0.26,26.83 61.65,26.83 61.65,0.26 0.26,0.26
GROUND on Top Layer: 56.76,15.84 61.4,15.84 61.4,6.02 55.5,6.02 55.5,14.91 56.76,14.91 56.76,14.92
POWER on Top Layer: 56.79,24.57 61.42,24.57 61.42,16.61 56.79,16.61
U on Top Layer: 0.32,11.96 9.91,11.96 11.63,10.24 19.18,10.24 19.18,5.82 16.01,5.82 16.01,7.77 11.68,7.77 9.99,6.09 0.32,6.09
V on Top Layer: 0.3,19.15 9.91,19.15 11.59,17.46 19.18,17.46 19.18,13.01 16.01,13.01 16.01,14.98 11.7,14.98 9.99,13.27 0.3,13.27
W on Top Layer: 0.28,26.6 9.93,26.6 11.68,24.85 19.2,24.85 19.2,20.46 16.02,20.46 16.02,22.39 11.67,22.39 10.01,20.73 0.28,20.73
